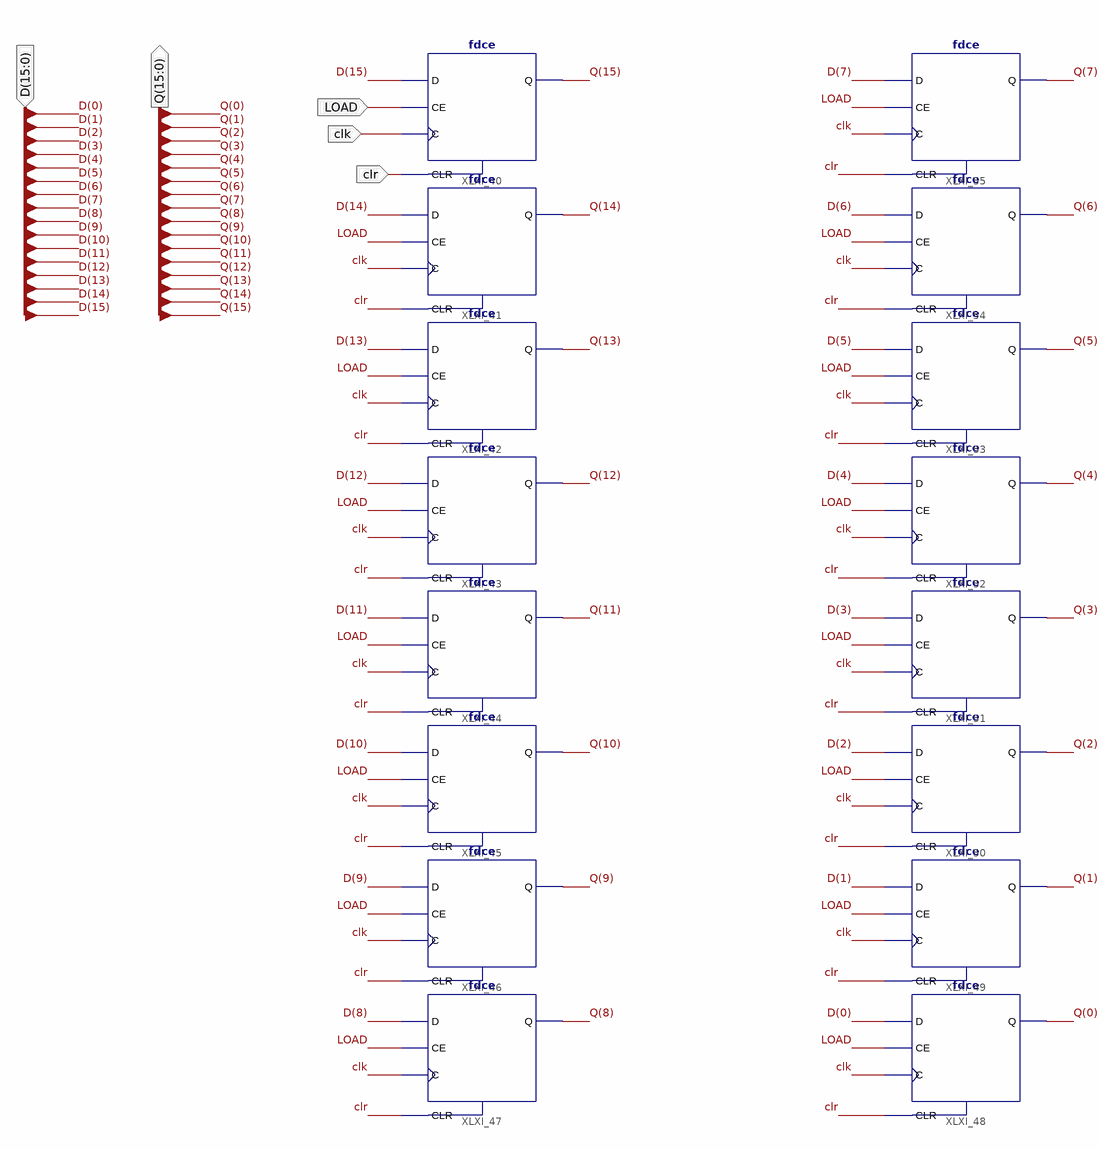
[diagram p0: schematic sheet 1]
// Xilinx ISE schematic D_flip_flop_16_bit.sch (virtex6) as structural Verilog: 16 symbols, 6 ports
module D_flip_flop_16_bit (
  input  clk,
  input  [15:0] D,
  input  LOAD,
  input  clr,
  output [15:0] Q
);

  fdce XLXI_40 (.C(clk), .CE(LOAD), .CLR(clr), .D(D[15]), .Q(Q[15]));
  fdce XLXI_41 (.C(clk), .CE(LOAD), .CLR(clr), .D(D[14]), .Q(Q[14]));
  fdce XLXI_42 (.C(clk), .CE(LOAD), .CLR(clr), .D(D[13]), .Q(Q[13]));
  fdce XLXI_43 (.C(clk), .CE(LOAD), .CLR(clr), .D(D[12]), .Q(Q[12]));
  fdce XLXI_44 (.C(clk), .CE(LOAD), .CLR(clr), .D(D[11]), .Q(Q[11]));
  fdce XLXI_45 (.C(clk), .CE(LOAD), .CLR(clr), .D(D[10]), .Q(Q[10]));
  fdce XLXI_46 (.C(clk), .CE(LOAD), .CLR(clr), .D(D[9]), .Q(Q[9]));
  fdce XLXI_47 (.C(clk), .CE(LOAD), .CLR(clr), .D(D[8]), .Q(Q[8]));
  fdce XLXI_48 (.C(clk), .CE(LOAD), .CLR(clr), .D(D[0]), .Q(Q[0]));
  fdce XLXI_49 (.C(clk), .CE(LOAD), .CLR(clr), .D(D[1]), .Q(Q[1]));
  fdce XLXI_50 (.C(clk), .CE(LOAD), .CLR(clr), .D(D[2]), .Q(Q[2]));
  fdce XLXI_51 (.C(clk), .CE(LOAD), .CLR(clr), .D(D[3]), .Q(Q[3]));
  fdce XLXI_52 (.C(clk), .CE(LOAD), .CLR(clr), .D(D[4]), .Q(Q[4]));
  fdce XLXI_53 (.C(clk), .CE(LOAD), .CLR(clr), .D(D[5]), .Q(Q[5]));
  fdce XLXI_54 (.C(clk), .CE(LOAD), .CLR(clr), .D(D[6]), .Q(Q[6]));
  fdce XLXI_55 (.C(clk), .CE(LOAD), .CLR(clr), .D(D[7]), .Q(Q[7]));
endmodule
